# Altium schematic sheet power_supply.SchDoc
size A
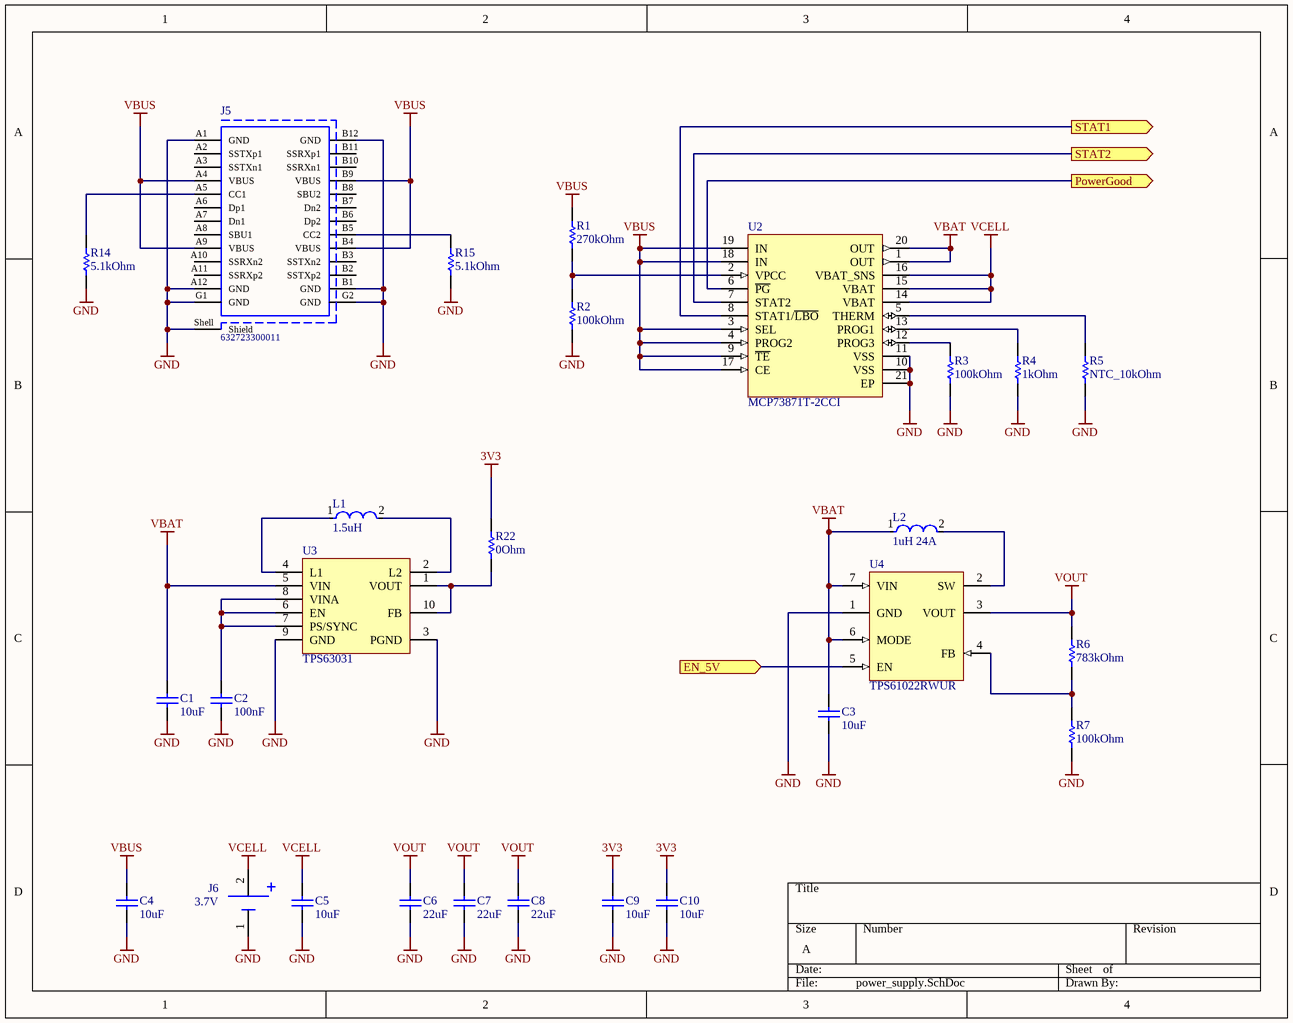
[diagram p0: power_supply.SchDoc]

## Parts
C1  10uF  [CAP_0804]
C2  100nF  [CAP_0804]
C3  10uF  [CAP_0804]
C4  10uF  [CAP_0804]
C5  10uF  [CAP_0804]
C6  22uF  [CAP_0804]
C7  22uF  [CAP_0804]
C8  22uF  [CAP_0804]
C9  10uF  [CAP_0804]
C10  10uF  [CAP_0804]
J5  632723300011  [USB_C_FEMALE]
J6  3.7V  [BATTERY - duplicate]
L1  1.5uH  [INDUCTOR_1.5UH]
L2  1uH 24A  [INDUCTOR_1UH]
R1  270kOhm  [RES_0804]
R2  100kOhm  [RES_0804]
R3  100kOhm  [RES_0804]
R4  1kOhm  [RES_0804]
R5  NTC_10kOhm  [RES_0804]
R6  783kOhm  [RES_0804]
R7  100kOhm  [RES_0804]
R14  5.1kOhm  [RES_0804]
R15  5.1kOhm  [RES_0804]
R22  0Ohm  [RES_0804]
U2  MCP73871T-2CCI  [MCP73871T-2CCI]
U3  TPS63031  [TPS63031]
U4  TPS61022RWUR  [TPS61022]

## Ports
EN_5V (in), PowerGood (out), STAT1 (out), STAT2 (out)

## Nets
3V3: C9.2 C10.2 R22.2
GND: C1.1 C2.1 C3.1 C4.1 C5.1 C6.1 C7.1 C8.1 C9.1 C10.1 J5.A1(GND) J5.A12(GND) J5.B1(GND) J5.B12(GND) J5.G1(GND) J5.G2(GND) J5.Shell(Shield) J6.1 R2.1 R3.1 R4.1 R5.1 R7.1 R14.1 R15.1 U2.10(VSS) U2.11(VSS) U2.21(EP) U3.3(PGND) U3.9(GND) U4.1(GND)
VBAT: C1.2 C3.2 L2.1 U2.1(OUT) U2.20(OUT) U3.5(VIN) U4.6(MODE) U4.7(VIN)
VBUS: C4.2 J5.A4(VBUS) J5.A9(VBUS) J5.B4(VBUS) J5.B9(VBUS) R1.2 U2.3(SEL) U2.4(PROG2) U2.9(~{TE}) U2.17(CE) U2.18(IN) U2.19(IN)
VCELL: C5.2 J6.2 U2.14(VBAT) U2.15(VBAT) U2.16(VBAT_SNS)
VOUT: C6.2 C7.2 C8.2 R6.2 U4.3(VOUT)
EN_5V: U4.5(EN) ; port EN_5V
PowerGood: U2.6(~{PG}) ; port PowerGood
STAT1: U2.8(STAT1/~{LBO}) ; port STAT1
STAT2: U2.7(STAT2) ; port STAT2
NetC2_2: C2.2 U3.6(EN) U3.7(PS/SYNC) U3.8(VINA)
NetJ5_A5: J5.A5(CC1) R14.2
NetJ5_B5: J5.B5(CC2) R15.2
NetL1_1: L1.1 U3.4(L1)
NetL1_2: L1.2 U3.2(L2)
NetL2_2: L2.2 U4.2(SW)
NetR1_1: R1.1 R2.2 U2.2(VPCC)
NetR3_2: R3.2 U2.12(PROG3)
NetR4_2: R4.2 U2.13(PROG1)
NetR5_2: R5.2 U2.5(THERM)
NetR6_1: R6.1 R7.2 U4.4(FB)
NetR22_1: R22.1 U3.1(VOUT) U3.10(FB)

Not connected (* = marked no-connect by the designer): J5 A2(SSTXp1) A3(SSTXn1) A6(Dp1) A7(Dn1) A8(SBU1) A10(SSRXn2) A11(SSRXp2) B2(SSTXp2) B3(SSTXn2) B6(Dp2) B7(Dn2) B8(SBU2) B10(SSRXn1) B11(SSRXp1)

## Library data of the parts
C1 C3-C5 C9 C10 = CAP_10UF: PartNumber: 1206GC102KAT1A; Manufacturer: AVX; Capacitance: 0.001uF; Dielectric: X7R; Tolerance: 10%; Tolerance (%): ±10%; Voltage Rating DC: 2000V; Package Reference: 1206; Datasheet Version: 11/2010; Mounting Technology: SurfaceMount; Manufacturer URL: http://www.avx.com/; Datasheet URL: https://datasheet.ciiva.com/11787/0900766b80ed4c37-11787781.pdf; Package Description: 2-Pin SMD, Body 3.4 x 1.8 mm; Case Size/Dimension: 1206; Rated Voltage: 2000V
C2 = CAP_100NF: PartNumber: 1206GC102KAT1A; Manufacturer: AVX; Capacitance: 0.001uF; Dielectric: X7R; Tolerance: 10%; Tolerance (%): ±10%; Voltage Rating DC: 2000V; Package Reference: 1206; Datasheet Version: 11/2010; Mounting Technology: SurfaceMount; Manufacturer URL: http://www.avx.com/; Datasheet URL: https://datasheet.ciiva.com/11787/0900766b80ed4c37-11787781.pdf; Package Description: 2-Pin SMD, Body 3.4 x 1.8 mm; Case Size/Dimension: 1206; Rated Voltage: 2000V
C6-C8 = CAP_22UF: PartNumber: 1206GC102KAT1A; Manufacturer: AVX; Capacitance: 0.001uF; Dielectric: X7R; Tolerance: 10%; Tolerance (%): ±10%; Voltage Rating DC: 2000V; Package Reference: 1206; Datasheet Version: 11/2010; Mounting Technology: SurfaceMount; Manufacturer URL: http://www.avx.com/; Datasheet URL: https://datasheet.ciiva.com/11787/0900766b80ed4c37-11787781.pdf; Package Description: 2-Pin SMD, Body 3.4 x 1.8 mm; Case Size/Dimension: 1206; Rated Voltage: 2000V
J5 = USB_C_FEMALE: USB 3.1 Type C Receptacle WR-COM, Horizontal, SMT / THT; Manufacturer: Wurth Elektronik; Rated Current: 5A; Contact Resistance: 30mOhm; Working Voltage: 20VDC; Operating Temperature: -40to105degC; Package Reference: 632723300011; Datasheet URL: https://katalog.we-online.de/em/datasheet/632723x00011%282%29.pdf; Manufacturer URL: http://www.we-online.de; Connector Type: USB3.1TypeC; Gender: Receptacle; Part Number: 632723300011; Mounting Technology: SMT/THT; Publisher: WurthElektronik; Packaging: TapeandReel; Orientation: Horizontal
J6 = BATTERY: CONN HEADER VERT 2POS 1.25MM; Manufacturer Part Number: 53047-0210; Manufacturer: Molex; Conn Gender: Male; Voltage Rating: 125V; Conn Orientation: Vertical; Number Of Contacts: 2; Current Rating: 1A; Description: CONNECTOR, HEADER, 2POS, 1ROW, 1.25MM; Contact Material: Tin; Temperature Range Low: -40°C; ComponentLink2URL: http://www.molex.com/webdocs/datasheets/pdf/en-us/0530470210_PCB_HEADERS.pdf; Mouser Description: 1.25mm Pitch PicoBlade™ Wire-to-Board Header, Vertical, with Friction Lock, 2 Circuits; Temperature Range High: +85°C; ComponentLink2Description: Datasheet; Automotive: No; RoHS: TRUE; Ambient Temperature Range High: +85°C; Octopart: https://octopart.com/53047-0210-molex-276772; Footprint Url: https://www.molex.com/pdm_docs/sd/530470210_sd.pdf; Lead Free: Yes; Pitch: 1.25mm; Temperature: -40°C to +85°C; Device Class L2: Headers and Wire Housings; Package: 0; Ambient Temperature Range Low: -40°C; Digikey Description: CONN HEADER VERT 2POS 1.25MM; Category: Conn; Device Class L3: unset; Number Of Rows: 1; Device Class L1: Connectors; Height: 4.4mm
L1 = INDUCTOR_1.5UH: FIXED IND 1.5UH 7A 4.3 MOHM SMD; Manufacturer: bourns; Manufacturer Part Number: SRU1048-1R5Y; Shielding: true; Saturation Current: 7.2A; Self Resonant Frequency: 70MHz; Q Factor: 14; Test Frequency: 100kHz; Tolerance: 30%; Core Material: Ferrite; Mouser Description: Inductor Power Shielded Wirewound 1.5uH 30% 100KHz 14Q-Factor Ferrite 7A 0.0043Ohm DCR T/R; Height: 5.1mm; Digikey Description: FIXED IND 1.5UH 7A 4.3 MOHM SMD; Rms Current: 7A; Automotive: No; Package: SRU1048; Device Class L1: Passive Components; ComponentLink2Description: Datasheet; Category: Ind; Device Class L2: Inductors; Octopart: https://octopart.com/sru1048-1r5y-bourns-1020385; Temperature Range Low: -40°C; Composition: Wirewound; ComponentLink2URL: https://www.bourns.com/docs/Product-Datasheets/SRU1048.pdf; Inductance: 1.5uH; RoHS: TRUE; Lead Free: Yes; Device Class L3: Fixed Inductors; Temperature: -40°C to +125°C; Value: 1.5uH; Temperature Range High: +125°C
L2 = INDUCTOR_1UH: FIXED IND 1UH 24A 3.5 MOHM SMD; Manufacturer Part Number: SRP1238A-1R0M; Manufacturer: Bourns; Q Factor: 15; Self Resonant Frequency: 40MHz; Series Resistance: 3.5mΩ; Automotive Grade: Grade 0; Shielding: true; Tolerance: 20%; Saturation Current: 40A; Test Frequency: 100kHz; Core Material: Carbonyl Powder; Digikey Description: FIXED IND 1UH 24A 3.5 MOHM SMD; Device Class L1: Passive Components; Device Class L3: Fixed Inductors; Value: 1uH; Rms Current: 24A; Mouser Description: Inductor Power Shielded Wirewound 1uH 20% 100KHz 15Q-Factor Carbonyl Powder 24A 3.5mOhm DCR Automotive T/R; Automotive: Yes; Octopart: https://octopart.com/srp1238a-1r0m-bourns-47099079; Temperature Range Low: -55°C; Category: Ind; Package: SRP1238A; Device Class L2: Inductors; ComponentLink2URL: https://www.bourns.com/docs/product-datasheets/srp1238a.pdf?sfvrsn=2a7391f1_31; Temperature Range High: +150°C; ComponentLink2Description: Datasheet; Composition: Wirewound; Height: 3.5mm; Lead Free: Yes; Temperature: -55°C to +150°C; RoHS: TRUE; Inductance: 1uH
R1 = RES_270K: Part Number: CRCW120647K0FKEA; Manufacturer: Vishay Dale
R2 R3 R7 = RES_100K: Part Number: CRCW120647K0FKEA; Manufacturer: Vishay Dale
R4 = RES_1K: Part Number: CRCW120647K0FKEA; Manufacturer: Vishay Dale
R5 = NTC_10K: Manufacturer: Vishay Dale; Part Number: NTHS1206N02N1002JE
R6 = RES_783K: Part Number: CRCW120647K0FKEA; Manufacturer: Vishay Dale
R14 R15 = RES_5.1K: Part Number: CRCW120647K0FKEA; Manufacturer: Vishay Dale
R22 = RES_0R: Part Number: CRCW120647K0FKEA; Manufacturer: Vishay Dale
U2 = MCP73871T-2CCI: Stand-Alone System Load Sharing and Li-Ion/Li-Polymer Battery Charge Management Controller, 4.4V, 20-Pin QFN, Industrial Temperature, Tape and Reel; DatasheetVersion: revB, May-2009; PackageReference: QFN-ML20; PackageDescription: 20-Lead Plastic Quad Flat, No Lead Package (ML) - 4x4x0.9 mm Body [QFN]; PackageVersion: revBB, Aug-2009
U3 = TPS63031: 3V3 BUCK BOOST TEXAS INSTRUMENTS - TPS63031DSKT - IC, DC DC CONV, 1A, 10SON, FULL REEL; Synchronous Rectifier: Yes; Output Voltage: 3.3V; Output Current: 800mA; Min Input Voltage: 1.8V; Max Input Voltage: 5.5V; Number of Outputs: 1; Switching Frequency: 2.4MHz; Output Type: Fixed; Quiescent Current: 25uA; Min Output Voltage: 3.267V; Efficiency: 96%; Topology: Buck-Boost; Supplier 1: Digi-Key; Manufacturer: Texas Instruments; Manufacturer Part Number: TPS63031DSKT; RoHS: Yes; Category: Voltage Regulators - Switching; Stock 1: 9581; Pricing 1: 1=2.15000, 10=1.93200, 25=1.82240, 100=1.45800 (USD); Mount: Surface Mount; Number of Pins: 10; Contact Plating: Gold; Min Operating Temperature: -40°C; Max Operating Temperature: 85°C; Packaging: Tape and Reel; Package Quantity: 1; Max Output Current: 800mA; Max Output Voltage: 3.3V; Nominal Output Voltage: 3.3V; Termination: SMD/SMT; Frequency: 2.4MHz; Max Supply Voltage: 5.5V; Min Supply Voltage: 1.8V; Length: 2.5mm; Height: 0.75mm; Width: 2.5mm; Radiation Hardening: No; Lead Free: Lead Free; REACH SVHC: No SVHC; ComponentLink1URL: https://datasheet.ciiva.com/2026/tps63031-2026128.pdf?src-supplier=Digi-Key; ComponentLink1Description: https://datasheet.ciiva.com/2026/tps63031-2026128.pdf?src-supplier=Digi-Key; ComponentLink2URL: https://datasheet.ciiva.com/4879/slvs696b-120507-4879760.pdf?src-supplier=Mouser; ComponentLink2Description: https://datasheet.ciiva.com/4879/slvs696b-120507-4879760.pdf?src-supplier=Mouser; ComponentLink3URL: https://datasheet.ciiva.com/22755/1781625-22755970.pdf?src-supplier=Farnell; ComponentLink3Description: https://datasheet.ciiva.com/22755/1781625-22755970.pdf?src-supplier=Farnell; ComponentLink4URL: https://datasheet.ciiva.com/15113/getdatasheetpartid-196765-15113811.pdf?src-supplier=Verical; ComponentLink4Description: https://datasheet.ciiva.com/15113/getdatasheetpartid-196765-15113811.pdf?src-supplier=Verical; ComponentLink5URL: https://datasheet.ciiva.com/41462/001014941-da-01-en-ic-reg-buck-bst-tps63031dskt-wson-10-tid-41462787.pdf?src-supplier=Conrad; ComponentLink5Description: https://datasheet.ciiva.com/41462/001014941-da-01-en-ic-reg-buck-bst-tps63031dskt-wson-10-tid-41462787.pdf?src-supplier=Conrad; ComponentLink6URL: https://datasheet.ciiva.com/7994/1856306-7994054.pdf?src-supplier=Element14; ComponentLink6Description: https://datasheet.ciiva.com/7994/1856306-7994054.pdf?src-supplier=Element14; ComponentLink7URL: https://datasheet.ciiva.com/3221/tps63030-3221514.pdf?src-supplier=Avnet; ComponentLink7Description: https://datasheet.ciiva.com/3221/tps63030-3221514.pdf?src-supplier=Avnet; ComponentLink8URL: https://datasheet.ciiva.com/26098/tps63030-26098574.pdf?src-supplier=Avnet+Europe; ComponentLink8Description: https://datasheet.ciiva.com/26098/tps63030-26098574.pdf?src-supplier=Avnet+Europe; Supplier Part Number 1: 296-23904-1-ND; Description: TEXAS INSTRUMENTS - TPS63031DSKT - IC, DC DC CONV, 1A, 10SON, FULL REEL
U4 = TPS61022: 5V BOOST; Manufacturer: Texas Instruments; Output Type: AdjustableProgrammable; Min Supply Voltage: 0.5V; Nominal Supply Current: 27uA; Standoff Height: 0mm; Max Junction Temp: +125°C; Output Current: 8A; Output Voltage: 2.2-5.5V; Max Supply Voltage: 5.5V; Switching Frequency: 600-1000kHz; Max Duty Cycle: 97%; Number Of Outputs: 1; Description: Switching Regulator IC     Output; Height: 1mm; Temperature Range High: +125°C; ComponentLink2Description: Datasheet; RoHS: TRUE; Octopart: https://octopart.com/tps61022rwur-texas+instruments-100045592; Switching Topology: Boost; Digikey Description: POWER MANAGEMENT; Lead Free: Yes; Manufacturer Part Number: TPS61022RWUR; Device Class L3: Voltage Regulators - Switching; Automotive: No; Device Class L1: Integrated Circuits (ICs); Package: RWU0007A; Category: IC; Temperature Range Low: -40°C; Mouser Description: 8-A boost converter with 0.5-V ultra-low input voltage 7-VQFN-HR -40 to 125; ComponentLink2URL: http://www.ti.com/lit/ds/symlink/tps61022.pdf; Temperature: -40°C to +125°C; Device Class L2: Power Management ICs